# EAGLE design ESP_PGMRm (EAGLE 9.4.1)
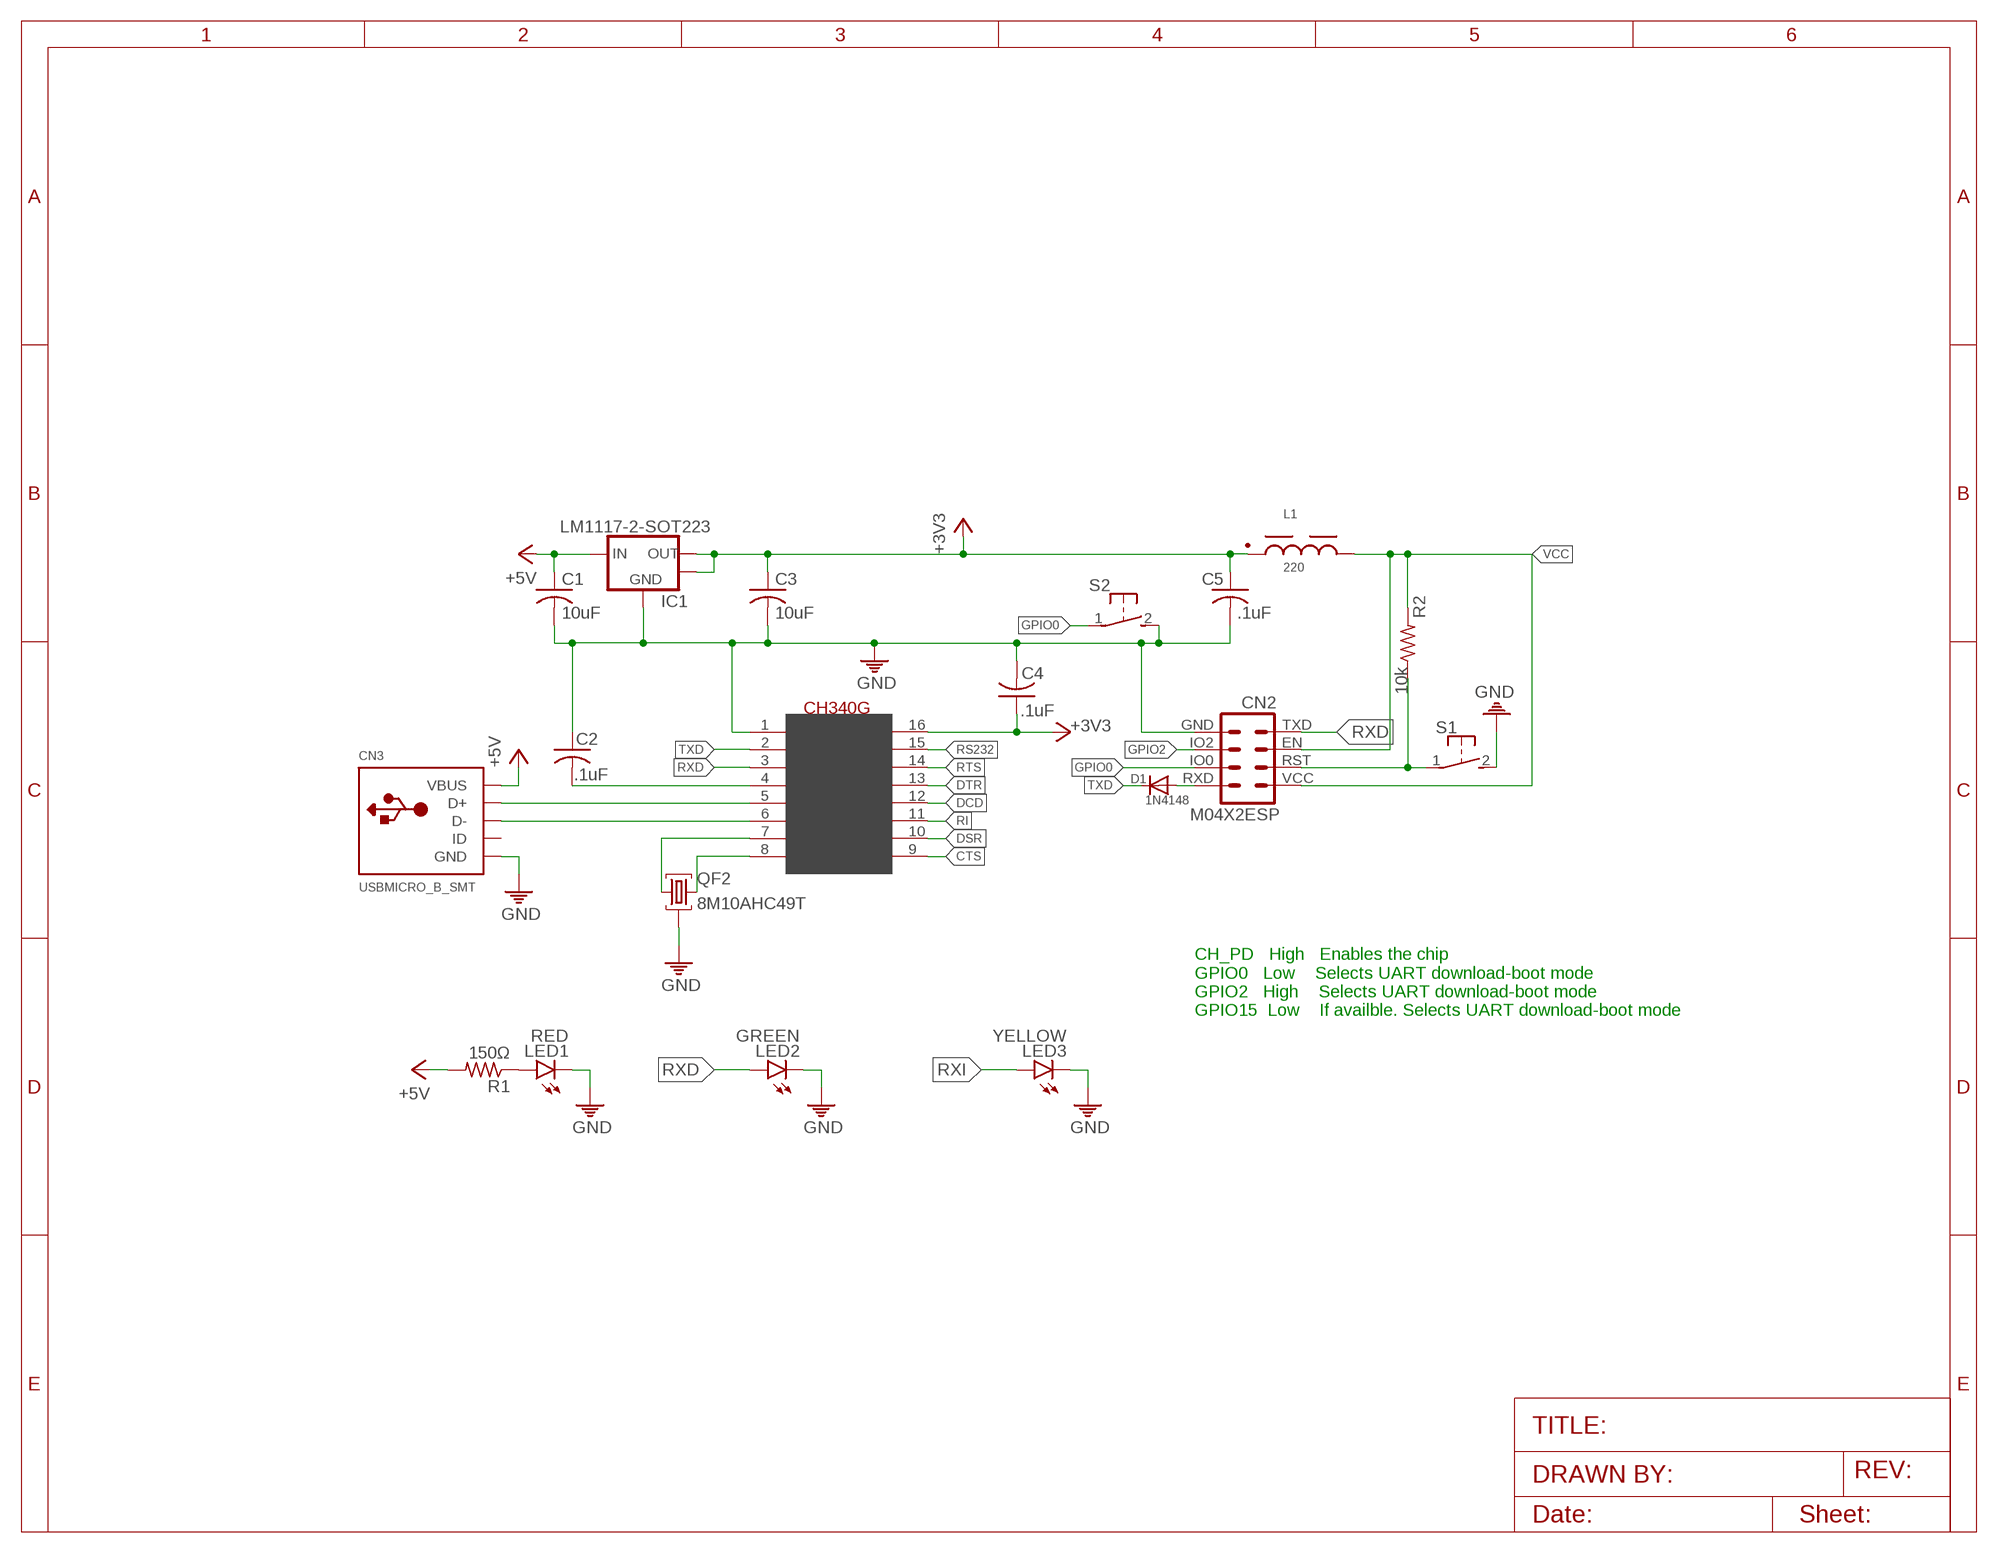
[diagram p0: schematic, sheet 1]

## Parts
C1  10uF  C-USC0805  [C0805]
C2  .1uF  C-USC0805  [C0805]
C3  10uF  C-USC0805  [C0805]
C4  .1uF  C-USC0805  [C0805]
C5  .1uF  C-USC0805  [C0805]
CN2  M04X2ESP  [2X04-ESP]
CN3  USBMICRO_B_SMT  [USB_MICRO_B_MID]
D1  1N4148  DIODE_SOD-123  [SOD-123]
IC1  LM1117-2-SOT223  [SOT-223-3]
IC2  CH340G  [SOIC16]
L1  220  WE-CBA_0805_782851102_WB/HS  [WE-CBA_0805(W=3)]
LED1  RED  LEDCHIPLED_1206  [CHIPLED_1206]
LED2  GREEN  LEDCHIPLED_1206  [CHIPLED_1206]
LED3  YELLOW  LEDCHIPLED_1206  [CHIPLED_1206]
QF2  8M10AHC49T  [HC49U]
R1  150Ω  R-US_M0805  [M0805]
R2  10k  R-US_R0805  [R0805]
S1  MOMENTARY-SWITCH-SPST-PTH-6.0X6.0-5MM  [TACTILE_SWITCH_PTH_6.0X6.0-5MM]
S2  MOMENTARY-SWITCH-SPST-PTH-6.0X6.0-5MM  [TACTILE_SWITCH_PTH_6.0X6.0-5MM]

## Nets
+3V3: C3.1 C4.1 C5.1 IC1.2(VOUT) IC1.4(HEATSINK) IC2.16(VCC) L1.1
+5V: C1.1 CN3.VBUS IC1.3(VIN) R1.2
CTS: IC2.9(CTS)
D+: CN3.D+ IC2.5(D+)
D-: CN3.D- IC2.6(D-)
DCD: IC2.12(DCD)
DSR: IC2.10(DSR)
DTR: IC2.13(DTR)
GND: C1.2 C2.1 C3.2 C4.2 C5.2 CN2.GND CN3.GND IC1.1(GND) IC2.1(GND) LED1.C LED2.C LED3.C QF2.2 S1.2(S) S2.2(S)
GPIO0: CN2.IO0 S2.1(P)
GPIO2: CN2.IO2
N$1: IC2.7(XI) QF2.1
N$2: IC2.8(XO) QF2.3
N$3: LED1.A R1.1
N$8: C2.2 IC2.4(V3)
RI: IC2.11(RI)
RS232: IC2.15(RS232)
RST: CN2.RST R2.1 S1.1(P)
RTS: IC2.14(RTS)
RXD: CN2.TXD IC2.3(RX) LED2.A
RXI: CN2.RXD D1.A LED3.A
TXD: D1.C IC2.2(TX)
VCC: CN2.EN CN2.VCC L1.2 R2.2
Unconnected: CN3.ID

## Notes on the sheet
- CH_PD   High   Enables the chip
  GPIO0   Low    Selects UART download-boot mode
  GPIO2   High    Selects UART download-boot mode
  GPIO15  Low    If availble. Selects UART download-boot mode

## Library data of the parts
C1-C5 = rcl:C-US: CAPACITOR, American symbol; SPICEPREFIX: C
CN2 = headers:M04X2ESP
CN3 = usb-serial:USB
D1 = diode:DIODE_: Diode SMADIODE - SMA Surface Mount Package 20V 1A Schottky Diode Digikey: 641-1014-6-ND DO-1N4148 - Through Hole Small Current Diode SOD-123 20V 1 A (.5mV Vf) Schottky Diode - Digikey: MBRX120TPMSCT-ND SOD-323 10V 570mA (.38mV Vf, 3ns) Schottky Diode - Digikey: ZLLS410CT-ND SOD-523 30V 30mA Schottky Diode (RB751S-40TE61) - Digikey: RB751S-40TE61CT-ND SOT23-R/W - SOT23 Package (R = Solder Paste/Reflow Ovens, W = Hand-Soldering) BAT54Film 40V 300mA - Digikey: 497-7162-1-ND Description Diode Switching 150mA 100V 400mW SOD123 Diodes Inc 1N4148W-7-F Switching Diode 100V, 2-Pin SOD-123 Source: Datasheet Technologies Attributes DESCRIPTION HEIGHT MANUFACTURER_NAME MANUFACTURER_PART_NUMBER MOUSER_PART_NUMBER 1N4148W-7-F Diode Switching 150mA 100V 400mW SOD123 Diodes Inc 1N4148W-7-F Switching Diode 100V, 2-Pin SOD-123 1.15mm Diodes Inc. 1N4148W-7-F 621-1N4148W-F
IC1 = regulators:LM1117-2: LDO Voltage Regulator NCP1117 series are low dropout positive voltage regulators that are capable of providing an output current that is in excess of 1.0 A with a maximum dropout voltage of 1.2 V at 800 mA over temperature. This series contains nine fixed output voltages of 1.5 V, 1.8 V, 1.9 V, 2.0 V, 2.5 V, 2.85 V, 3.3 V, 5.0 V, and 12 V that have no minimum load requirement to maintain regulation. Also included is an adjustable output version that can be programmed from 1.25 V to 18.8 V with two external resistors. datasheet.pdf <http://www.onsemi.com/pub_link/Collateral/NCP1117-D.PDF> LM1117-N is a series of low dropout voltage regulators of 1.2V at 800mA of load current. It has the same pin-out as Texas Instruments' industry standard LM317. The LM1117-N is available in an adjustable version, available in five fixed voltages, 1.8V, 2.5V, 2.85V, 3.3V, and 5V. The LM1117-N offers current limiting and thermal shutdown. Its circuit includes a zener trimmed to within ±1%. datasheet.pdf <http://www.ti.com/lit/ds/symlink/lm1117-n.pdf>
IC2 = usb-serial:CH340G
L1 = Wurth_Elektronik_Passive_rev19b:WE-CBA_0805: WE-CBA SMD EMI Suppression Ferrite Bead Characteristics Reliable Ni-Sn electrodes High rated current up to 5A Recommended soldering: Reflow Operating temperature: -55°C to +125°C Applications * Perfect as data line filter and for uncoupling of distribution voltage *This special SMD chip bead ferrites can be put directly on the printed circuit board. They offer excellent anti-EMI properties and low DC-resistance. Placed very close next to the interference source even with smallest size 0402,maximal impedance at 1000 Ω can be reached. *High Speed: "High Speed " SMD ferrites WE-CBF have lower impedance in the lower frequency ranges thus they have only a low attenuation for fast signals. Application e.g. USB 2.0, IEEE 1394,LVDS *Wide Band: "Wide Band" SMD ferrites WE-CBF already show high impedance in low frequency range. Therefore they are wide band through the whole spectrum. Application e.g. control signats, RS232, RS422, DC/DC converter *High Current: "High Current " SMD ferrites WE-CBF are designed for high current (over 1 A). The rated current refers to 40K self-heating. High current SMD ferrites are available in all there types (High Speed, Wide Band and High Frequency). Application e.g. power supply, DC/DC converter *Advice: Pay attention for the use of SMD-Ferrites for high current>1A and ambient temperature over +85°C that the rated current has to be reduced when temperature is above +85°C (Derating). *At+100°C environment temperature the maximal rated current has to add up to only 60% of the data sheet value ,without an overload of the component. Variant abbreviation WB means WIDE BAND HS means HIGH SPEED HC means HIGH CURRENT <http://katalog.we-online.de/media/images/v2/Family_WE-CBA.jpg> Details see: http://katalog.we-online.de/en/pbs/WE-CBA/ Created: 2015-02-02 2015 (C) Wurth Elektronik
LED1-LED3 = led:LED: LED OSRAM: - CHIPLED LG R971, LG N971, LY N971, LG Q971, LY Q971, LO R971, LY R971 LH N974, LH R974 LS Q976, LO Q976, LY Q976 LO Q996 - Hyper CHIPLED LW Q18S LB Q993, LB Q99A, LB R99A - SideLED LS A670, LO A670, LY A670, LG A670, LP A670 LB A673, LV A673, LT A673, LW A673 LH A674 LY A675 LS A676, LA A676, LO A676, LY A676, LW A676 LS A679, LY A679, LG A679 - Hyper Micro SIDELED® LS Y876, LA Y876, LO Y876, LY Y876 LT Y87S - SmartLED LW L88C, LW L88S LB L89C, LB L89S, LG L890 LS L89K, LO L89K, LY L89K LS L896, LA L896, LO L896, LY L896 - TOPLED LS T670, LO T670, LY T670, LG T670, LP T670 LSG T670, LSP T670, LSY T670, LOP T670, LYG T670 LG T671, LOG T671, LSG T671 LB T673, LV T673, LT T673, LW T673 LH T674 LS T676, LA T676, LO T676, LY T676, LB T676, LH T676, LSB T676, LW T676 LB T67C, LV T67C, LT T67C, LS T67K, LO T67K, LY T67K, LW E67C LS E67B, LA E67B, LO E67B, LY E67B, LB E67C, LV E67C, LT E67C LW T67C LS T679, LY T679, LG T679 LS T770, LO T770, LY T770, LG T770, LP T770 LB T773, LV T773, LT T773, LW T773 LH T774 LS E675, LA E675, LY E675, LS T675 LS T776, LA T776, LO T776, LY T776, LB T776 LHGB T686 LT T68C, LB T68C - Hyper Mini TOPLED® LB M676 - Mini TOPLED Santana® LG M470 LS M47K, LO M47K, LY M47K Source: http://www.osram.convergy.de LUXEON: - LUMILED® LXK2-PW12-R00, LXK2-PW12-S00, LXK2-PW14-U00, LXK2-PW14-V00 LXK2-PM12-R00, LXK2-PM12-S00, LXK2-PM14-U00 LXK2-PE12-Q00, LXK2-PE12-R00, LXK2-PE12-S00, LXK2-PE14-T00, LXK2-PE14-U00 LXK2-PB12-K00, LXK2-PB12-L00, LXK2-PB12-M00, LXK2-PB14-N00, LXK2-PB14-P00, LXK2-PB14-Q00 LXK2-PR12-L00, LXK2-PR12-M00, LXK2-PR14-Q00, LXK2-PR14-R00 LXK2-PD12-Q00, LXK2-PD12-R00, LXK2-PD12-S00 LXK2-PH12-R00, LXK2-PH12-S00 LXK2-PL12-P00, LXK2-PL12-Q00, LXK2-PL12-R00 Source: www.luxeon.com KINGBRIGHT: KA-3528ASYC Source: www.kingbright.com
QF2 = crystal:8M10AHC49T: Monolithic Crystal Filters Source: www.vanlong.com; OC_FARNELL: unknown; OC_NEWARK: unknown
R1 = resistor:R-US_: RESISTOR, American symbol
R2 = rcl:R-US_: RESISTOR, American symbol; SPICEPREFIX: R
S1 S2 = switch:MOMENTARY-SWITCH-SPST: Momentary Switch (Pushbutton) - SPST Normally-open (NO) SPST momentary switches (buttons, pushbuttons). Variants PTH-12MM - 12mm square, through-hole Momentary Pushbutton Switch - 12mm Square <https://www.sparkfun.com/products/9190> (COM-09190) PTH-6.0MM, PTH-6.0MM-KIT - 6.0mm square, through-hole Mini Pushbutton Switch <https://www.sparkfun.com/products/97> (COM-00097) KIT package intended for soldering kit's - only one side of pads' copper is exposed. PTH-RIGHT-ANGLE-KIT - Right-angle, through-hole Right Angle Tactile Button <https://www.sparkfun.com/products/10791> - Used on SparkFun BigTime Watch Kit <https://www.sparkfun.com/products/11734> SMD-12MM - 12mm square, surface-mount Tactile Button - SMD (12mm) <https://www.sparkfun.com/products/12993> (COM-12993) Used on SparkFun PicoBoard <https://www.sparkfun.com/products/11888> SMD-4.5MM - 4.5mm Square Trackball Switch Used on SparkFun Blackberry Trackballer Breakout <https://www.sparkfun.com/products/13169> SMD-4.6MMX2.8MM - 4.60mm x 2.80mm, surface mount Used on SparkFun SAMD21 Mini Breakout <https://www.sparkfun.com/products/13664> SMD-5.2MM, SMD-5.2-REDUNDANT - 5.2mm square, surface-mount Mini Pushbutton Switch - SMD <https://www.sparkfun.com/products/8720> (COM-08720) Used on Arduino Pro Mini <https://www.sparkfun.com/products/11114> REDUNDANT package connects both switch circuits together SMD-6.0X3.5MM - 6.0 x 3.5mm, surface mount Momentary Reset Switch SMD <https://www.sparkfun.com/products/8229> (COM-08229) SMD-6.2MM-TALL - 6.2mm square, surface mount Tactile Button - SMD (6mm) <https://www.sparkfun.com/products/12992> Used on SparkFun Digital Sandbox <https://www.sparkfun.com/products/12651> SMD-RIGHT-ANGLE - Right-angle, surface mount Used on SparkFun Block for Intel® Edison - Arduino <https://www.sparkfun.com/products/13036>

## Net classes
1 vcc: width 0.305 mm

## Board
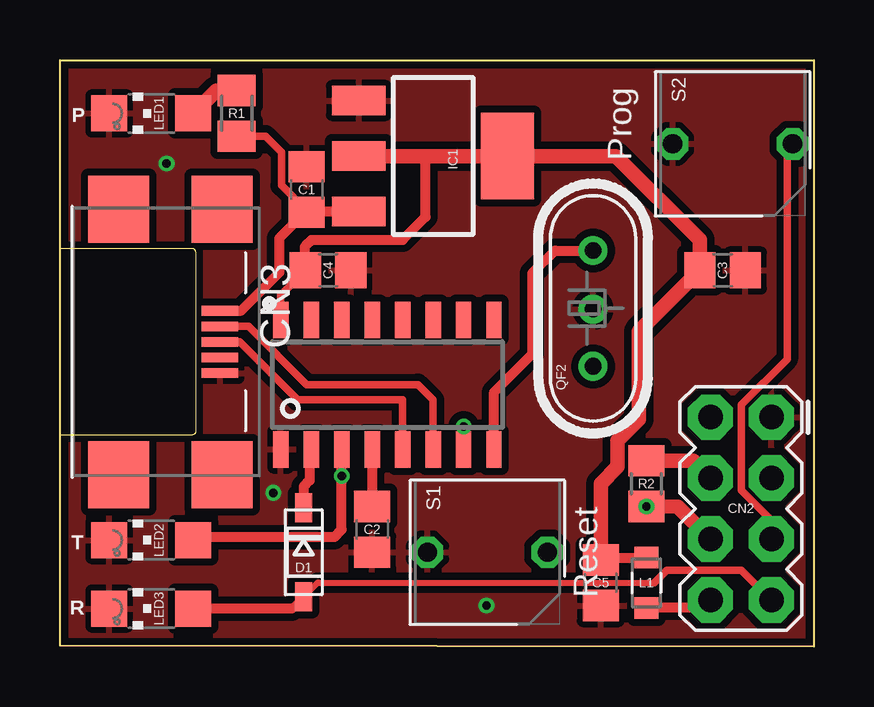
[diagram p1: board, top side]
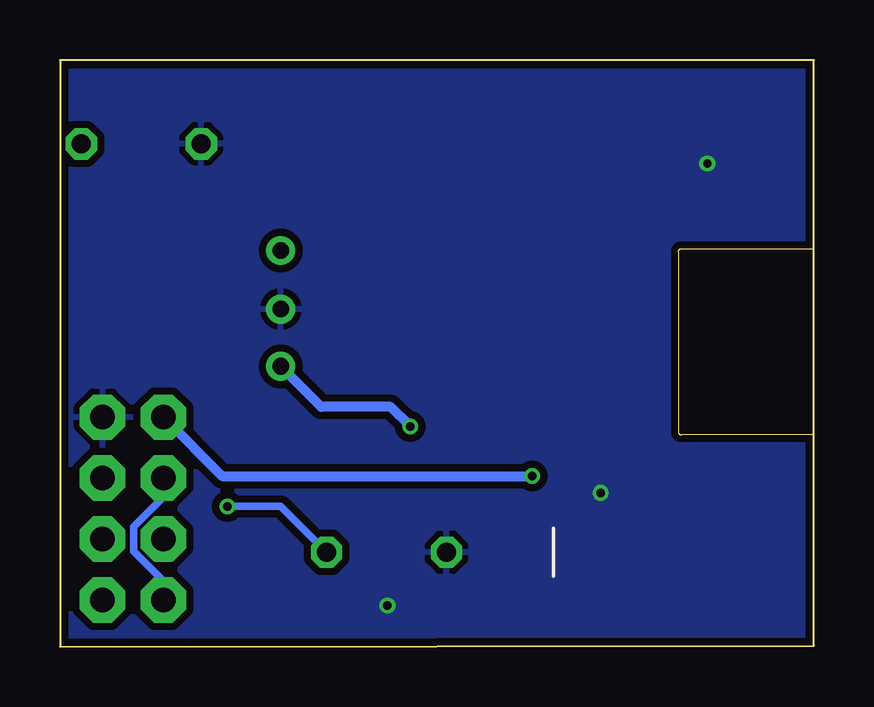
[diagram p2: board, bottom side, seen from below]

Size 31.43 x 24.45 mm. Coordinates in mm from the lower left corner, seen from the top.
Outline: 0,0.05 0,24.45 31.43,24.45 31.43,0 0,0.05
Copper layers (1*16): Top 0.035mm / dielectric 1.5mm / Bottom 0.035mm
Design rules "Elecrow_2-layer_eagle_rule": minimum track width 6mil, minimum drill 12mil, track to track 6mil, track to pad 6mil, pad to pad 6mil, via to via 6mil, smd to smd 0mil, copper to edge 10mil, drill to drill 10mil, minimum pad ring 10mil, minimum via ring 6mil, stop-mask expansion 2mil, vias tented up to drill 100mil, thermal gap 10mil

### Footprints (pad centres in the part's own frame; a part is rotated, then mirrored left to right if it is on the bottom)
C0805 = smd 1.3 x 1.5: 1 -0.95,0; 2 0.95,0
2X04-ESP = drill 1.016 pad 1.88 octagon: EN -1.27,-1.27; GND -3.81,1.27; IO0 1.27,1.27; IO2 -1.27,1.27; RST 1.27,-1.27; RXD 3.81,1.27; TXD -3.81,-1.27; VCC 3.81,-1.27
USB_MICRO_B_MID = smd 0.4 x 1.524: D+ 0,3.685; D- -0.65,3.685; GND 1.3,3.685; ID 0.65,3.685; VBUS -1.3,3.685 | smd 2.794 x 2.54: P$1 -5.537,-0.533; P$2 5.535,-0.533; P$4 5.535,3.785; P$5 -5.537,3.785
SOD-123 = smd 1.2 x 0.7: A 1.85,0; C -1.85,0
SOT-223-3 = smd 1.219 x 2.235: 1 -2.311,-3.099; 2 0,-3.099; 3 2.311,-3.099 | smd 3.6 x 2.2: 4 0,3.099
SOIC16 = smd 0.635 x 1.524: 1 -4.445,-2.695; 2 -3.175,-2.695; 3 -1.905,-2.695; 4 -0.635,-2.695; 5 0.635,-2.695; 6 1.905,-2.695; 7 3.175,-2.695; 8 4.445,-2.695; 9 4.445,2.695; 10 3.175,2.695; 11 1.905,2.695; 12 0.635,2.695; 13 -0.635,2.695; 14 -1.905,2.695; 15 -3.175,2.695; 16 -4.445,2.695
WE-CBA_0805(W=3) = smd 0.9 x 1: 1 -1.05,0; 2 1.05,0
CHIPLED_1206 = smd 1.5 x 1.5: A 0,-1.75; C 0,1.75
HC49U = drill 0.7 pad 1.2: 1 -2.413,0; 2 -0.027,0; 3 2.413,0
M0805 = smd 1.3 x 1.6: 1 -0.95,0; 2 0.95,0
R0805 = smd 1.3 x 1.5: 1 -0.95,0; 2 0.95,0
TACTILE_SWITCH_PTH_6.0X6.0-5MM = drill 0.8 octagon: 1 0,0; 2 5,0

### Placement (x,y rotation side)
C1  10.29,19.05 90 top
C2  13.02,4.89 90 top
C3  27.62,15.68 0 top
C4  11.18,15.68 0 top
C5  22.54,2.67 270 top
CN2  28.39,5.76 270 top
CN3  2.98,12.7 270 top
D1  10.16,3.94 270 top
IC1  15.56,20.45 270 top
IC2  13.65,10.92 0 top
L1  24.45,2.67 270 top
LED1  3.81,22.23 90 top
LED2  3.81,4.45 90 top
LED3  3.81,1.59 90 top
QF2  22.23,14.1 90 top
R1  7.37,22.23 270 top
R2  24.45,6.79 90 top
S1  20.32,3.94 180 top
S2  30.54,20.95 180 top

### Tracks (layer width: path | path; a pad name or v marks a point on that pad's centre or on a via)
+3V3
  Top 0.305: IC2.16 9.21,14.67 C4.1
  Top 0.406: C4.1 10.23,16.7 10.48,16.95 14.29,16.95 15.24,17.91 15.24,20.45 | C5.1 22.64,3.72 L1.1
  Top 0.61: IC1.2 15.24,20.45 IC1.4 23.18,20.45 26.67,16.95 C3.1 24.13,13.14 24.13,9.47 23.24,8.58 23.24,7.49 22.54,6.79 C5.1
+5V
  Top 0.305: R1.2 8.57,21.27 9.23,20.61 9.23,19.22 10.26,18.19 10.26,18.14
  Top 0.406: C1.1 10.32,18.14 | CN3.VBUS 7.56,14 9.14,15.59 9.14,17.02 10.26,18.14 10.32,18.14 | 10.32,18.14 IC1.3
D+
  Top 0.305: IC2.5 14.29,10.29 9.91,10.29 7.49,12.7 CN3.D+
D-
  Top 0.305: IC2.6 15.56,10.29 14.92,10.92 10.29,10.92 7.86,13.35 CN3.D-
GND  (via drill 0.35)
  other vias: 17.78,1.71 8.89,6.41 4.45,20.13
  pour Bottom (isolate 0.305): 0,0 31.56,0 31.56,24.45 0,24.45
  pour Top (isolate 0.305): 0,0 31.56,0 31.56,24.45 0,24.45
GPIO0
  Top 0.305: S2.1 30.32,20.73 30.32,11.99 28.41,10.09 28.41,6.51 29.66,5.27 CN2.IO0
N$1  (via drill 0.35)
  Top 0.406: IC2.7 v16.83,9.18
  Bottom 0.406: v16.83,9.18 17.65,10 20.54,10 QF2.1
N$2
  Top 0.406: IC2.8 18.1,10.6 19.68,12.19 19.68,15.56 20.64,16.51 QF2.3
N$3
  Top 0.61: R1.1 6.51,23.18 LED1.A
N$8
  Top 0.406: IC2.4 C2.2
RST  (via drill 0.35)
  Top 0.61: R2.1 25.77,5.84 CN2.RST
  Bottom 0.305: R2.1 22.23,5.84 S1.1
  other vias: 24.45,5.84
RXD  (via drill 0.35)
  Top 0.406: LED2.A 5.69,4.57 11.43,4.57 11.75,4.89 v11.75,7.11 IC2.3
  Bottom 0.406: CN2.TXD 24.66,7.11 v11.75,7.11
RXI
  Top 0.254: 24.79,2.67 10.79,2.67 10.75,2.67 D1.A
  Top 0.305: 24.79,2.67 25.31,3.19 28.41,3.19 CN2.RXD | D1.A 9.66,1.59
  Top 0.406: 6.06,2.09 LED3.A 9.66,1.59
TXD
  Top 0.406: IC2.2 10.41,8.16 10.41,6.93 10.16,6.68 D1.C
VCC
  Top 0.406: L1.2 24.46,1.63 26.8,1.63 CN2.VCC
  Top 0.61: CN2.EN 26.41,7.75 R2.2
  Bottom 0.305: CN2.EN 27.12,6.25 28.36,5 28.36,3.97 27.12,2.73 CN2.VCC

### Text on the board
tPlace: P | Prog | T | Reset | R